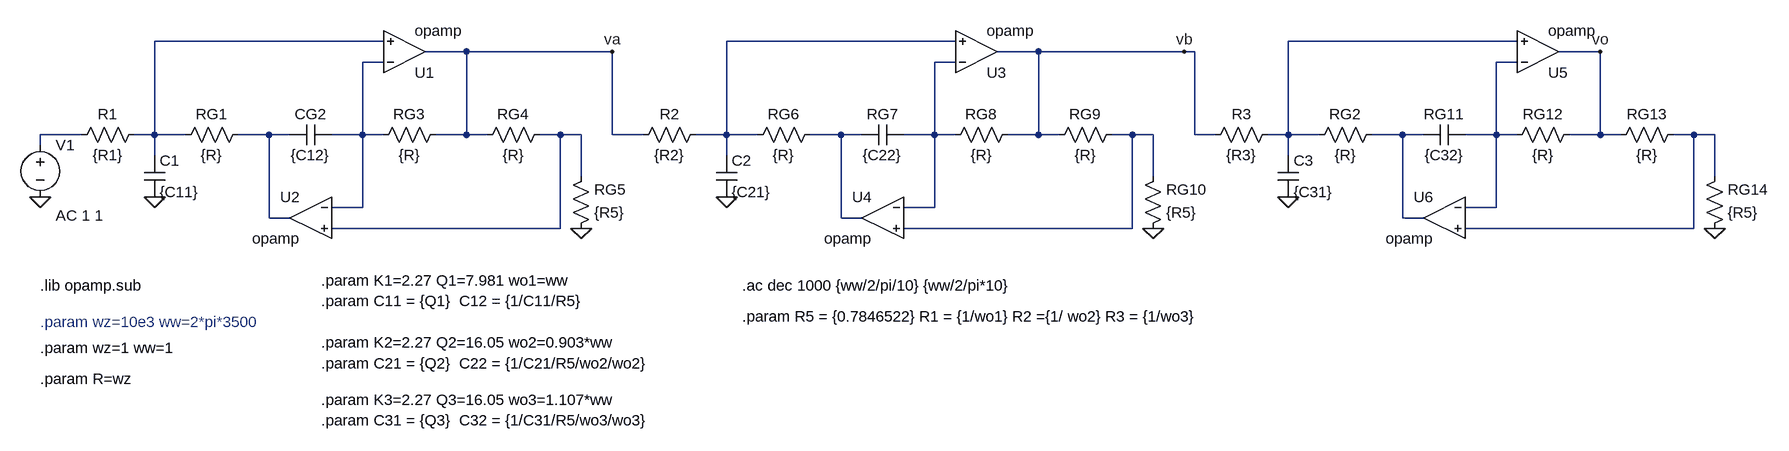
[diagram p0: schematic Activo.asc]
Activo.asc, the LTspice schematic file:
Version 4
SHEET 1 2264 828
WIRE -240 208 -592 208
WIRE 640 208 288 208
WIRE 1504 208 1152 208
WIRE -112 224 -176 224
WIRE 112 224 -112 224
WIRE 768 224 704 224
WIRE 992 224 768 224
WIRE 1008 224 992 224
WIRE 1632 224 1568 224
WIRE -240 240 -272 240
WIRE 640 240 608 240
WIRE 1504 240 1472 240
WIRE -704 352 -768 352
WIRE -592 352 -592 208
WIRE -592 352 -624 352
WIRE -544 352 -592 352
WIRE -416 352 -464 352
WIRE -384 352 -416 352
WIRE -272 352 -272 240
WIRE -272 352 -320 352
WIRE -240 352 -272 352
WIRE -112 352 -112 224
WIRE -112 352 -160 352
WIRE -80 352 -112 352
WIRE 32 352 0 352
WIRE 64 352 32 352
WIRE 112 352 112 224
WIRE 160 352 112 352
WIRE 288 352 288 208
WIRE 288 352 240 352
WIRE 336 352 288 352
WIRE 464 352 416 352
WIRE 496 352 464 352
WIRE 608 352 608 240
WIRE 608 352 560 352
WIRE 640 352 608 352
WIRE 768 352 768 224
WIRE 768 352 720 352
WIRE 800 352 768 352
WIRE 912 352 880 352
WIRE 944 352 912 352
WIRE 1008 352 1008 224
WIRE 1040 352 1008 352
WIRE 1152 352 1152 208
WIRE 1152 352 1120 352
WIRE 1200 352 1152 352
WIRE 1328 352 1280 352
WIRE 1360 352 1328 352
WIRE 1472 352 1472 240
WIRE 1472 352 1424 352
WIRE 1504 352 1472 352
WIRE 1632 352 1632 224
WIRE 1632 352 1584 352
WIRE 1664 352 1632 352
WIRE 1776 352 1744 352
WIRE 1808 352 1776 352
WIRE -768 368 -768 352
WIRE -592 384 -592 352
WIRE 288 384 288 352
WIRE 1152 384 1152 352
WIRE 64 416 64 352
WIRE 944 416 944 352
WIRE 1808 416 1808 352
WIRE -272 464 -272 352
WIRE -272 464 -320 464
WIRE 608 464 608 352
WIRE 608 464 560 464
WIRE 1472 464 1472 352
WIRE 1472 464 1424 464
WIRE -416 480 -416 352
WIRE -384 480 -416 480
WIRE 464 480 464 352
WIRE 496 480 464 480
WIRE 1328 480 1328 352
WIRE 1360 480 1328 480
WIRE 32 496 32 352
WIRE 32 496 -320 496
WIRE 912 496 912 352
WIRE 912 496 560 496
WIRE 1776 496 1776 352
WIRE 1776 496 1424 496
FLAG -768 448 0
FLAG 64 496 0
FLAG -592 448 0
FLAG 944 496 0
FLAG 288 448 0
FLAG 1808 496 0
FLAG 1152 448 0
FLAG 112 224 va
FLAG 992 224 vb
FLAG 1632 224 vo
SYMBOL voltage -768 352 R0
WINDOW 123 24 124 Left 2
WINDOW 39 0 0 Left 0
SYMATTR Value2 AC 1 1
SYMATTR InstName V1
SYMATTR Value ""
SYMBOL res -608 336 R90
WINDOW 0 0 56 VBottom 2
WINDOW 3 32 56 VTop 2
SYMATTR InstName R1
SYMATTR Value {R1}
SYMBOL res -448 336 R90
WINDOW 0 0 56 VBottom 2
WINDOW 3 32 56 VTop 2
SYMATTR InstName RG1
SYMATTR Value {R}
SYMBOL cap -608 384 R0
SYMATTR InstName C1
SYMATTR Value {C11}
SYMBOL OpAmps\\opamp -208 288 M180
SYMATTR InstName U1
SYMBOL cap -320 336 R90
WINDOW 0 0 32 VBottom 2
WINDOW 3 32 32 VTop 2
SYMATTR InstName CG2
SYMATTR Value {C12}
SYMBOL res -144 336 R90
WINDOW 0 0 56 VBottom 2
WINDOW 3 32 56 VTop 2
SYMATTR InstName RG3
SYMATTR Value {R}
SYMBOL res 16 336 R90
WINDOW 0 0 56 VBottom 2
WINDOW 3 32 56 VTop 2
SYMATTR InstName RG4
SYMATTR Value {R}
SYMBOL res 48 512 M180
WINDOW 0 36 76 Left 2
WINDOW 3 36 40 Left 2
SYMATTR InstName RG5
SYMATTR Value {R5}
SYMBOL OpAmps\\opamp -352 416 M0
SYMATTR InstName U2
SYMBOL res 432 336 R90
WINDOW 0 0 56 VBottom 2
WINDOW 3 32 56 VTop 2
SYMATTR InstName RG6
SYMATTR Value {R}
SYMBOL cap 272 384 R0
SYMATTR InstName C2
SYMATTR Value {C21}
SYMBOL OpAmps\\opamp 672 288 M180
SYMATTR InstName U3
SYMBOL cap 560 336 R90
WINDOW 0 0 32 VBottom 2
WINDOW 3 32 32 VTop 2
SYMATTR InstName RG7
SYMATTR Value {C22}
SYMBOL res 736 336 R90
WINDOW 0 0 56 VBottom 2
WINDOW 3 32 56 VTop 2
SYMATTR InstName RG8
SYMATTR Value {R}
SYMBOL res 896 336 R90
WINDOW 0 0 56 VBottom 2
WINDOW 3 32 56 VTop 2
SYMATTR InstName RG9
SYMATTR Value {R}
SYMBOL res 928 512 M180
WINDOW 0 36 76 Left 2
WINDOW 3 36 40 Left 2
SYMATTR InstName RG10
SYMATTR Value {R5}
SYMBOL OpAmps\\opamp 528 416 M0
SYMATTR InstName U4
SYMBOL res 1296 336 R90
WINDOW 0 0 56 VBottom 2
WINDOW 3 32 56 VTop 2
SYMATTR InstName RG2
SYMATTR Value {R}
SYMBOL cap 1136 384 R0
SYMATTR InstName C3
SYMATTR Value {C31}
SYMBOL OpAmps\\opamp 1536 288 M180
SYMATTR InstName U5
SYMBOL cap 1424 336 R90
WINDOW 0 0 32 VBottom 2
WINDOW 3 32 32 VTop 2
SYMATTR InstName RG11
SYMATTR Value {C32}
SYMBOL res 1600 336 R90
WINDOW 0 0 56 VBottom 2
WINDOW 3 32 56 VTop 2
SYMATTR InstName RG12
SYMATTR Value {R}
SYMBOL res 1760 336 R90
WINDOW 0 0 56 VBottom 2
WINDOW 3 32 56 VTop 2
SYMATTR InstName RG13
SYMATTR Value {R}
SYMBOL res 1792 512 M180
WINDOW 0 36 76 Left 2
WINDOW 3 36 40 Left 2
SYMATTR InstName RG14
SYMATTR Value {R5}
SYMBOL OpAmps\\opamp 1392 416 M0
SYMATTR InstName U6
SYMBOL res 256 336 R90
WINDOW 0 0 56 VBottom 2
WINDOW 3 32 56 VTop 2
SYMATTR InstName R2
SYMATTR Value {R2}
SYMBOL res 1136 336 R90
WINDOW 0 0 56 VBottom 2
WINDOW 3 32 56 VTop 2
SYMATTR InstName R3
SYMATTR Value {R3}
TEXT -768 584 Left 2 !.lib opamp.sub
TEXT -768 640 Left 2 ;.param wz=10e3 ww=2*pi*3500
TEXT -768 728 Left 2 !.param R=wz
TEXT -768 680 Left 2 !.param wz=1 ww=1
TEXT -336 576 Left 2 !.param K1=2.27 Q1=7.981 wo1=ww
TEXT -336 608 Left 2 !.param C11 = {Q1}  C12 = {1/C11/R5}
TEXT -336 672 Left 2 !.param K2=2.27 Q2=16.05 wo2=0.903*ww
TEXT -336 760 Left 2 !.param K3=2.27 Q3=16.05 wo3=1.107*ww
TEXT 312 584 Left 2 !.ac dec 1000 {ww/2/pi/10} {ww/2/pi*10}
TEXT 312 632 Left 2 !.param R5 = {0.7846522} R1 = {1/wo1} R2 ={1/ wo2} R3 = {1/wo3}
TEXT -336 704 Left 2 !.param C21 = {Q2}  C22 = {1/C21/R5/wo2/wo2}
TEXT -336 792 Left 2 !.param C31 = {Q3}  C32 = {1/C31/R5/wo3/wo3}

The netlist it stands for:
* Activo.asc
V1 N007 0 AC 1 1
R1 N001 N007 {R1}
RG1 N008 N001 {R}
C1 N001 0 {C11}
XU1 N004 N001 va opamp Aol=100K GBW=10Meg  ; pins invin noninvin out
CG2 N004 N008 {C12}
RG3 va N004 {R}
RG4 N009 va {R}
RG5 0 N009 {R5}
XU2 N004 N009 N008 opamp Aol=100K GBW=10Meg  ; pins invin noninvin out
RG6 N010 N002 {R}
C2 N002 0 {C21}
XU3 N005 N002 vb opamp Aol=100K GBW=10Meg  ; pins invin noninvin out
C§RG7 N005 N010 {C22}
RG8 vb N005 {R}
RG9 N011 vb {R}
RG10 0 N011 {R5}
XU4 N005 N011 N010 opamp Aol=100K GBW=10Meg  ; pins invin noninvin out
RG2 N012 N003 {R}
C3 N003 0 {C31}
XU5 N006 N003 vo opamp Aol=100K GBW=10Meg  ; pins invin noninvin out
C§RG11 N006 N012 {C32}
RG12 vo N006 {R}
RG13 N013 vo {R}
RG14 0 N013 {R5}
XU6 N006 N013 N012 opamp Aol=100K GBW=10Meg  ; pins invin noninvin out
R2 N002 va {R2}
R3 N003 vb {R3}
.lib opamp.sub
* .param wz=10e3 ww=2*pi*3500
.param R=wz
.param wz=1 ww=1
.param K1=2.27 Q1=7.981 wo1=ww
.param C11 = {Q1}  C12 = {1/C11/R5}
.param K2=2.27 Q2=16.05 wo2=0.903*ww
.param K3=2.27 Q3=16.05 wo3=1.107*ww
.ac dec 1000 {ww/2/pi/10} {ww/2/pi*10}
.param R5 = {0.7846522} R1 = {1/wo1} R2 ={1/ wo2} R3 = {1/wo3}
.param C21 = {Q2}  C22 = {1/C21/R5/wo2/wo2}
.param C31 = {Q3}  C32 = {1/C31/R5/wo3/wo3}
.backanno
.end

* Results of the author's LTspice run, read from the files saved beside the schematic
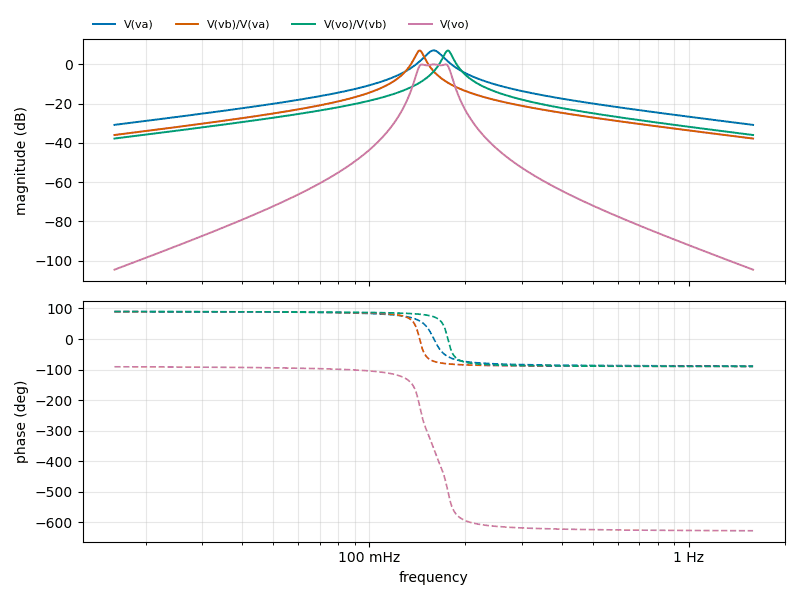
[diagram p1: AC Analysis of Activo.asc, plotted from the saved traces]
* AC Analysis, 1 run:
*   V(va): -30.82 dB at 15.92 mHz, -30.82 dB at 1.592 Hz, peak 7.12 dB at 159.2 mHz, 3 dB below the peak at 149.5 mHz and 169.5 mHz
*   V(vb)/V(va): -35.98 dB at 15.92 mHz, -37.79 dB at 1.592 Hz, peak 7.06 dB at 143.8 mHz, 3 dB below the peak at 139.3 mHz and 148.3 mHz
*   V(vo)/V(vb): -37.78 dB at 15.92 mHz, -35.98 dB at 1.592 Hz, peak 7.05 dB at 176.1 mHz, 3 dB below the peak at 170.7 mHz and 181.8 mHz
*   V(vo): -104.58 dB at 15.92 mHz, -104.59 dB at 1.592 Hz, peak -0.01 dB at 159.2 mHz, 3 dB below the peak at 141.7 mHz and 178.7 mHz